# EAGLE board Proiect2026Hagi (EAGLE 9.7.0)
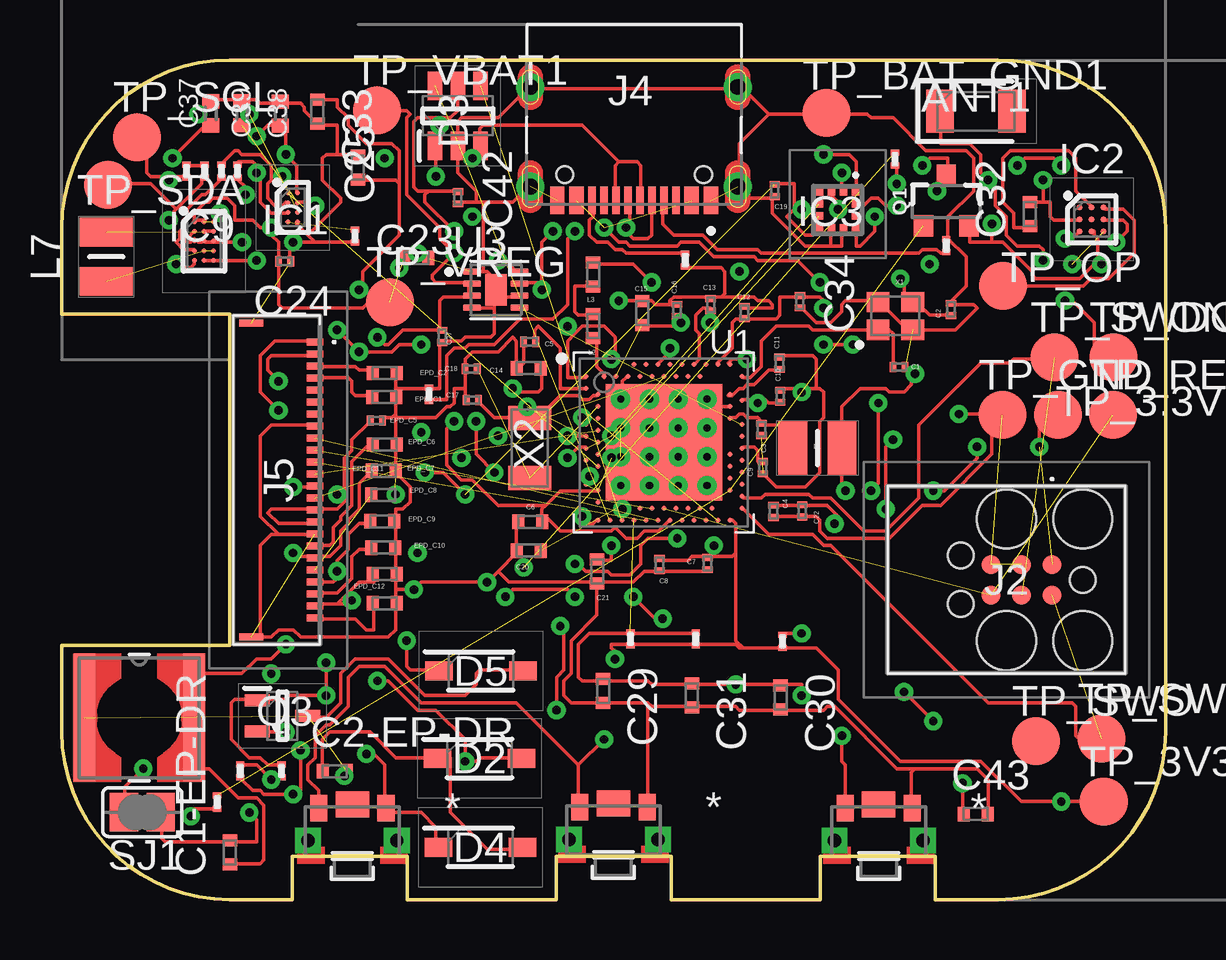
[diagram p2: board, top side]
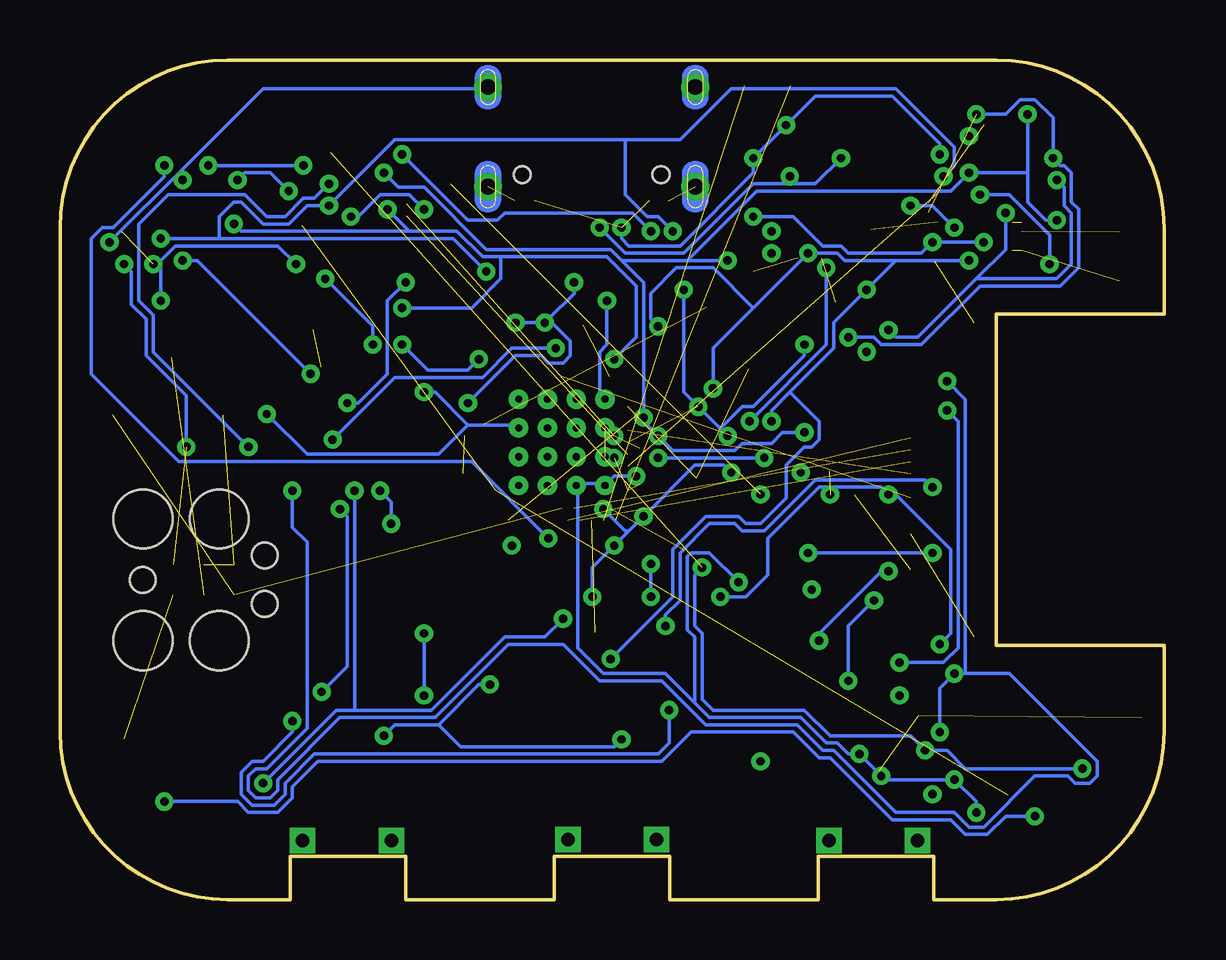
[diagram p3: board, bottom side, seen from below]

Size 46 x 35 mm. Coordinates in mm from the lower left corner, seen from the top.
Outline: 39,0 36.4,0 36.4,1.8 31.6,1.8 31.6,0 25.4,0 25.4,1.8 20.6,1.8 20.6,0 14.4,0 14.4,1.8 9.6,1.8 9.6,0 7,0 arc-90 0,7 0,10.6 7,10.6 7,24.4 0,24.4 0,28 arc-90 7,35 39,35 arc-90 46,28 46,7 arc-90 39,0
Copper layers (1+2*15+16): Top 0.035mm / dielectric 1.5mm / Route2 0.035mm / dielectric 0.15mm / Route15 0.035mm / dielectric 0.2mm / Bottom 0.035mm
Design rules "Fusion Electronics Design Rules *": minimum track width 6mil, minimum drill 0.35mm, track to track 6mil, track to pad 6mil, pad to pad 6mil, via to via 6mil, smd to smd 6mil, copper to edge 40mil, drill to drill 6mil, minimum pad ring 10mil, minimum via ring 8mil, stop-mask expansion 4mil, vias tented up to drill 9999mil, thermal gap 10mil

## Footprints (pad centres in the part's own frame; a part is rotated, then mirrored left to right if it is on the bottom)
2450AT18B100E_ANTC3216X140N = smd 1.15 x 1.8: 1 -1.5,0; 2 1.5,0
NORDIC_NRF_3_RESC0201_L = smd 0.28 x 0.43: 1 -0.255,0; 2 0.255,0
NORDIC_NRF_3_RESC0402_L = smd 0.5 x 0.6: 1 -0.5,0; 2 0.5,0
PERFECT_0402_0402 = smd 0.6 x 0.7: 1 -0.5,0; 2 0.5,0
ESP32_C6_LIBRARY_5_SOD3716X135N = smd 1.15 x 0.8: 1 -1.75,0; 2 1.75,0
ESP32_C6_LIBRARY_3_SOT95P280X145-6N = smd 1.2 x 0.6: 1 -1.25,0.95; 2 -1.25,0; 3 -1.25,-0.95; 4 1.25,-0.95; 5 1.25,0; 6 1.25,0.95
BQ25180YBGR_BGA8C40P2X4_100X155X50 = smd 0.2 x 0.2: A1 -0.2,0.6; A2 0.2,0.6; B1 -0.2,0.2; B2 0.2,0.2; C1 -0.2,-0.2; C2 0.2,-0.2; D1 -0.2,-0.6; D2 0.2,-0.6
DRV2605YZFR_BGA9C50P3X3_144X144X62 = smd 0.25 x 0.25: A1 -0.5,0.5; A2 0,0.5; A3 0.5,0.5; B1 -0.5,0; B2 0,0; B3 0.5,0; C1 -0.5,-0.5; C2 0,-0.5; C3 0.5,-0.5
BMA423_BMA423 = smd 0.3 x 0.35: 1 -0.75,-0.775; 2 -0.25,-0.775; 3 0.25,-0.775; 4 0.75,-0.775; 7 0.75,0.775; 8 0.25,0.775; 9 -0.25,0.775; 10 -0.75,0.775 | smd 0.35 x 0.3: 5 0.775,-0.25; 6 0.775,0.25; 11 -0.775,0.25; 12 -0.775,-0.25
RT6160AWSC_BGA15C40P3X5_140X230X60 = smd 0.216 x 0.216: A1 -0.4,0.8; A2 0,0.8; A3 0.4,0.8; B1 -0.4,0.4; B2 0,0.4; B3 0.4,0.4; C1 -0.4,0; C2 0,0; C3 0.4,0; D1 -0.4,-0.4; D2 0,-0.4; D3 0.4,-0.4; E1 -0.4,-0.8; E2 0,-0.8; E3 0.4,-0.8
TC2030-IDC_TC2030IDC = smd 0.783 x 0.783: 1 -0.953,-0.635; 2 -0.953,0.635; 3 0.317,-0.635; 4 0.317,0.635; 5 1.588,-0.635; 6 1.588,0.635 | hole 2.451: -2.223,-2.54; -2.223,2.54; 0.952,-2.54; 0.952,2.54 | hole 1.067: -2.223,0; 2.857,-1.016; 2.857,1.016
KH-TYPE-C-16P_KINGHELM_KH-TYPE-C-16P = smd 0.6 x 1.15: A1_B12 -3.2,4.725; A4_B9 -2.4,4.725; A9_B4 2.4,4.725; A12_B1 3.2,4.725 | smd 0.3 x 1.15: A5 -1.25,4.725; A6 -0.25,4.725; A7 0.25,4.725; A8 1.25,4.725; B5 1.75,4.725; B6 0.75,4.725; B7 -0.75,4.725; B8 -1.75,4.725 | drill 0.65 pad 1.05: SH1 -4.32,0; SH2 4.32,0; SH3 -4.32,4.15; SH4 4.32,4.15 | hole 0.7: -2.89,3.65; 2.89,3.65
503480-2400_5034802400 = smd 0.3 x 0.7: 1 -5.75,1.525; 2 -5.25,1.525; 3 -4.75,1.525; 4 -4.25,1.525; 5 -3.75,1.525; 6 -3.25,1.525; 7 -2.75,1.525; 8 -2.25,1.525; 9 -1.75,1.525; 10 -1.25,1.525; 11 -0.75,1.525; 12 -0.25,1.525; 13 0.25,1.525; 14 0.75,1.525; 15 1.25,1.525; 16 1.75,1.525; 17 2.25,1.525; 18 2.75,1.525; 19 3.25,1.525; 20 3.75,1.525; 21 4.25,1.525; 22 4.75,1.525; 23 5.25,1.525; 24 5.75,1.525 | smd 0.3 x 1: MP1 -6.54,-1.125; MP2 6.54,-1.125
MLP2016SR47MT0S1_INDC2016X100N = smd 1.2 x 2.2: 1 -1.028,0; 2 1.028,0
NORDIC_NRF_2_RESC0402_L = smd 0.5 x 0.6: 1 -0.5,0; 2 0.5,0
ESP32_C6_LIBRARY_2_IND_4828-WE-TPC_WRE = smd 0.9 x 5.3: 1 -2.286,0; 2 2.286,0
ESP32_C6_LIBRARY_4_ESP32_C6_LIBRARY_4_ESP32_C6_LIBRARY_4_ESP32_C6_LIBRARY_4_ESP32_WROVER_SPARKFUN-DISCRETESEMI_SOT23-3 = smd 0.8 x 0.9: 1 -0.95,-1; 2 0.95,-1; 3 0,1.1
ESP32_C6_LIBRARY_6_SOT65P210X110-3N = smd 1.05 x 0.5: 1 -1.05,0.65; 2 -1.05,-0.65; 3 1.05,0
CPF0201D7K68C1_0201 = smd 0.35 x 0.25: 1 0,0.275; 2 0,-0.275
ESP32_C6_LIBRARY_7_JUMPER_SJ = smd 1.168 x 1.6: 1 -0.762,0; 2 0.762,0
2025-10-22_07-23-44_LIBRARY_SW_EVP-AKE31A_PAN = smd 0.711 x 1.092: 1 -1.4,-0.972; 2 1.4,-0.972 | drill 0.559 pad 0.914 square: 3 -1.848,0.381; 4 1.848,0.381 | smd 1.397 x 1.092: 5 0,-1.124
HECTOR_WATCH_1_TP20R = smd 2 x 2: TP 0,0
NORDIC_NRF_4_AQFN50P700X700X85_HS-74N = smd 4.85 x 4.85: P$74 0,0 | drill 0.3 pad 0.6: P$75 -1.8,1.8; P$76 -0.6,1.8; P$77 0.6,1.8; P$78 1.8,1.8; P$79 -1.8,0.6; P$80 -0.6,0.6; P$81 0.6,0.6; P$82 1.8,0.6; P$83 -1.8,-0.6; P$84 -0.6,-0.6; P$85 0.6,-0.6; P$86 1.8,-0.6; P$87 -1.8,-1.8; P$88 -0.6,-1.8; P$89 0.6,-1.8; P$90 1.8,-1.8 | smd 0.2 x 0.2: P$A8 -1.25,3.25; P$A10 -0.75,3.25; P$A12 -0.25,3.25; P$A14 0.25,3.25; P$A16 0.75,3.25; P$A18 1.25,3.25; P$A20 1.75,3.25; P$A22 2.25,3.25; P$A23 2.75,3.25; P$AA24 3.25,-2.25; P$AB2 -2.75,-2.5; P$AC5 -2,-2.75; P$AC9 -1,-2.75; P$AC11 -0.5,-2.75; P$AC13 0,-2.75; P$AC15 0.5,-2.75; P$AC17 1,-2.75; P$AC19 1.5,-2.75; P$AC21 2,-2.75; P$AC24 3.25,-2.75; P$AD2 -2.75,-3.25; P$AD4 -2.25,-3.25; P$AD6 -1.75,-3.25; P$AD8 -1.25,-3.25; P$AD10 -0.75,-3.25; P$AD12 -0.25,-3.25; P$AD14 0.25,-3.25; P$AD16 0.75,-3.25; P$AD18 1.25,-3.25; P$AD20 1.75,-3.25; P$AD22 2.25,-3.25; P$AD23 2.75,-3.25; P$B1 -3.25,2.75; P$B3 -2.5,2.75; P$B5 -2,2.75; P$B7 -1.5,2.75; P$B9 -1,2.75; P$B11 -0.5,2.75; P$B13 0,2.75; P$B15 0.5,2.75; P$B17 1,2.75; P$B19 1.5,2.75; P$B24 3.25,2.75; P$C1 -3.25,2.25; P$D2 -2.75,2; P$D23 2.75,2; P$E24 3.25,1.75; P$F2 -2.75,1.5; P$F23 2.75,1.5; P$G1 -3.25,1.25; P$H2 -2.75,1; P$H23 2.75,1; P$J1 -3.25,0.75; P$J24 3.25,0.75; P$K2 -2.75,0.5; P$L1 -3.25,0.25; P$L24 3.25,0.25; P$M2 -2.75,0; P$N1 -3.25,-0.25; P$N24 3.25,-0.25; P$P2 -2.75,-0.5; P$P23 2.75,-0.5; P$R1 -3.25,-0.75; P$R24 3.25,-0.75; P$T2 -2.75,-1; P$T23 2.75,-1; P$U1 -3.25,-1.25; P$U24 3.25,-1.25; P$V23 2.75,-1.5; P$W1 -3.25,-1.75; P$W24 3.25,-1.75; P$Y2 -2.75,-2; P$Y23 2.75,-2
ESP32_C6_LIBRARY_SON50P200X200X80-9N = smd 0.76 x 0.27: 1 -0.985,0.75; 2 -0.985,0.25; 3 -0.985,-0.25; 4 -0.985,-0.75; 5 0.985,-0.75; 6 0.985,-0.25; 7 0.985,0.25; 8 0.985,0.75 | smd 0.9 x 1.3: 9 0,0
NORDIC_NRF_BT-XTAL_2016_N = smd 0.95 x 0.85: 1 -0.725,-0.575; 2 0.725,-0.575; 3 0.725,0.575; 4 -0.725,0.575
NORDIC_NRF_1_XTAL_3215_N = smd 1 x 1.8: 1 -1.25,0; 2 1.25,0

## Placement (x,y rotation side)
ANT1  2450AT18B100E  [2450AT18B100E_ANTC3216X140N]  38.09,32.86 0 top
C1  12pF  [NORDIC_NRF_3_RESC0201_L]  34.89,22.2 0 top
C1-EP-DR  10uF  [NORDIC_NRF_3_RESC0402_L]  7.01,1.97 90 top
C2  12pF  [NORDIC_NRF_3_RESC0201_L]  37.06,24.6 90 top
C2-EP-DR  4.7uF/25V  [NORDIC_NRF_3_RESC0402_L]  11.38,5.35 0 top
C3  1pF  [NORDIC_NRF_3_RESC0201_L]  29.16,19.6 270 top
C4  1pF  [NORDIC_NRF_3_RESC0201_L]  29.66,16.18 270 top
C5  100nF  [NORDIC_NRF_3_RESC0201_L]  19.5,23.25 180 top
C6  4.7uF  [NORDIC_NRF_3_RESC0402_L]  19.52,15.75 180 top
C7  100nF  [NORDIC_NRF_3_RESC0201_L]  26.91,14.01 270 top
C8  100nF  [NORDIC_NRF_3_RESC0201_L]  24.91,13.96 270 top
C9  820pF  [NORDIC_NRF_3_RESC0201_L]  29.21,18.01 270 top
C10  N.C  [NORDIC_NRF_3_RESC0201_L]  29.94,20.98 90 top
C11  100pF  [NORDIC_NRF_3_RESC0201_L]  29.91,22.36 90 top
C12  100nF  [NORDIC_NRF_3_RESC0201_L]  28.45,24.47 90 top
C13  N.C  [NORDIC_NRF_3_RESC0201_L]  27.04,24.8 90 top
C14  4.7uF  [NORDIC_NRF_3_RESC0402_L]  19.47,22.15 180 top
C15  1.0uF  [NORDIC_NRF_3_RESC0402_L]  24.19,24.44 90 top
C16  47Nf  [NORDIC_NRF_3_RESC0201_L]  25.64,24.56 90 top
C17  12pF  [NORDIC_NRF_3_RESC0201_L]  17.11,20.82 0 top
C18  12pF  [NORDIC_NRF_3_RESC0201_L]  17.06,22.12 0 top
C19  100nF  [NORDIC_NRF_3_RESC0201_L]  29.71,29.56 270 top
C20  4.7uF  [NORDIC_NRF_3_RESC0402_L]  19.47,14.55 180 top
C21  4.7uF  [NORDIC_NRF_3_RESC0402_L]  22.31,13.68 270 top
C22  N.C  [NORDIC_NRF_3_RESC0201_L]  30.86,16.2 270 top
C23  0.1uF  [NORDIC_NRF_3_RESC0402_L]  14.77,26.75 180 top
C24  10uF  [NORDIC_NRF_3_RESC0201_L]  9.29,26.6 180 top
C25  22uF  [NORDIC_NRF_3_RESC0402_L]  12.34,30.52 90 top
C27  0.1uF  [NORDIC_NRF_3_RESC0201_L]  15.86,23.47 270 top
C29  1uF  [NORDIC_NRF_3_RESC0402_L]  22.56,8.69 270 top
C30  1uF  [NORDIC_NRF_3_RESC0402_L]  29.96,8.43 270 top
C31  1uF  [NORDIC_NRF_3_RESC0402_L]  26.26,8.51 270 top
C32  1uF  [NORDIC_NRF_3_RESC0402_L]  40.34,28.57 90 top
C33  22uF  [NORDIC_NRF_3_RESC0402_L]  10.66,32.85 270 top
C34  0.1uF  [NORDIC_NRF_3_RESC0201_L]  30.76,24.92 270 top
C37  1uF  [PERFECT_0402_0402]  6.21,32.77 90 top
C38  1uF  [PERFECT_0402_0402]  9.11,32.76 90 top
C39  10uF  [PERFECT_0402_0402]  7.51,32.78 90 top
C42  0.1uF  [NORDIC_NRF_3_RESC0201_L]  16.51,29.26 270 top
C43  4.7uF  [NORDIC_NRF_3_RESC0402_L]  38.08,3.57 0 top
D2  MBR0530  [ESP32_C6_LIBRARY_5_SOD3716X135N]  17.41,5.88 0 top
D3  USBLC6-2SC6Y  [ESP32_C6_LIBRARY_3_SOT95P280X145-6N]  16.51,32.67 90 top
D4  MBR0530  [ESP32_C6_LIBRARY_5_SOD3716X135N]  17.45,2.18 0 top
D5  MBR0530  [ESP32_C6_LIBRARY_5_SOD3716X135N]  17.47,9.53 0 top
EPD_C1  1uF/50V  [NORDIC_NRF_3_RESC0402_L]  13.45,20.95 180 top
EPD_C2  1uF/50V  [NORDIC_NRF_3_RESC0402_L]  13.46,21.95 180 top
EPD_C5  0.1uF/50V  [NORDIC_NRF_3_RESC0201_L]  13.11,19.97 180 top
EPD_C6  1uF/50V  [NORDIC_NRF_3_RESC0402_L]  13.47,18.97 180 top
EPD_C7  1uF/50V  [NORDIC_NRF_3_RESC0402_L]  13.43,17.87 180 top
EPD_C8  1uF/50V  [NORDIC_NRF_3_RESC0402_L]  13.39,16.87 180 top
EPD_C9  1uF/50V  [NORDIC_NRF_3_RESC0402_L]  13.35,15.77 180 top
EPD_C10  1uF/50V  [NORDIC_NRF_3_RESC0402_L]  13.41,14.67 180 top
EPD_C11  1uF/50V  [NORDIC_NRF_3_RESC0402_L]  13.47,13.57 180 top
EPD_C12  1uF/50V  [NORDIC_NRF_3_RESC0402_L]  13.47,12.35 180 top
IC1  BQ25180YBGR_BQ25180YBGR  [BQ25180YBGR_BGA8C40P2X4_100X155X50]  9.63,28.85 0 top
IC2  DRV2605YZFR  [DRV2605YZFR_BGA9C50P3X3_144X144X62]  42.92,28.35 0 top
IC3  BMA421  [BMA423_BMA423]  32.33,28.75 180 top
IC9  RT6160AWSC  [RT6160AWSC_BGA15C40P3X5_140X230X60]  5.93,27.45 0 top
J2  TC2030-IDC  [TC2030-IDC_TC2030IDC]  40.32,13.33 180 top
J4  KH-TYPE-C-16P  [KH-TYPE-C-16P_KINGHELM_KH-TYPE-C-16P]  23.85,33.87 180 top
J5  503480-2400  [503480-2400_5034802400]  9.03,17.49 270 top
L1  3.9nH  [MLP2016SR47MT0S1_INDC2016X100N]  31.49,18.82 0 top
L2  10uH  [NORDIC_NRF_2_RESC0402_L]  22.14,23.9 90 top
L3  15nH  [NORDIC_NRF_2_RESC0402_L]  22.14,26.05 90 top
L5  68uH  [ESP32_C6_LIBRARY_2_IND_4828-WE-TPC_WRE]  3.23,7.58 0 top
L7  FTC252012SR47MBCA  [MLP2016SR47MT0S1_INDC2016X100N]  1.86,26.8 270 top
Q1  20V/4.2A/52mΩ/1.4W  [ESP32_C6_LIBRARY_4_ESP32_C6_LIBRARY_4_ESP32_C6_LIBRARY_4_ESP32_C6_LIBRARY_4_ESP32_WROVER_SPARKFUN-DISCRETESEMI_SOT23-3]  36.86,29.09 0 top
Q3  SI1308EDL-T1-GE3  [ESP32_C6_LIBRARY_6_SOT65P210X110-3N]  9.2,7.66 0 top
R1_EP_DR  0.47  [CPF0201D7K68C1_0201]  34.72,30.86 0 top
R1_USB  5K1  [CPF0201D7K68C1_0201]  36.86,27.26 0 top
R2  0  [CPF0201D7K68C1_0201]  7.32,30.36 0 top
R2-USB1  5K1  [CPF0201D7K68C1_0201]  25.98,26.66 0 top
R2_EP_DR  10K  [CPF0201D7K68C1_0201]  9.16,5.36 180 top
R3  0  [CPF0201D7K68C1_0201]  15.3,21.06 0 top
R4  0  [CPF0201D7K68C1_0201]  6.66,30.36 0 top
R5  10K  [CPF0201D7K68C1_0201]  23.7,10.86 0 top
R7  10K  [CPF0201D7K68C1_0201]  30.04,10.76 0 top
R8  10K  [CPF0201D7K68C1_0201]  26.42,10.86 0 top
R9  10K  [CPF0201D7K68C1_0201]  12.22,27.66 180 top
R17  3K3  [CPF0201D7K68C1_0201]  5.2,30.36 0 top
R18  3K3  [CPF0201D7K68C1_0201]  5.96,30.36 0 top
R_PWR_EPD1  10k  [CPF0201D7K68C1_0201]  6.48,4.06 0 top
R_TYPE_SEL  2.2  [CPF0201D7K68C1_0201]  7.44,5.36 0 top
SJ1  [ESP32_C6_LIBRARY_7_JUMPER_SJ]  3.36,3.64 180 top
SW_DN1  2025-10-22_07-23-44_LIBRARY_EVP-AKE31ASW_EVP-AKE31A_PAN  [2025-10-22_07-23-44_LIBRARY_SW_EVP-AKE31A_PAN]  12.11,2.84 180 top
SW_ENT1  2025-10-22_07-23-44_LIBRARY_EVP-AKE31ASW_EVP-AKE31A_PAN  [2025-10-22_07-23-44_LIBRARY_SW_EVP-AKE31A_PAN]  22.99,2.89 180 top
SW_UP1  2025-10-22_07-23-44_LIBRARY_EVP-AKE31ASW_EVP-AKE31A_PAN  [2025-10-22_07-23-44_LIBRARY_SW_EVP-AKE31A_PAN]  34.04,2.84 180 top
TP_3.3V  HECTOR_WATCH_1_TPTP20R  [HECTOR_WATCH_1_TP20R]  41.51,20.2 0 top
TP_3V3  HECTOR_WATCH_1_TPTP20R  [HECTOR_WATCH_1_TP20R]  43.42,4.08 0 top
TP_BAT_GND1  HECTOR_WATCH_1_TPTP20R  [HECTOR_WATCH_1_TP20R]  31.86,32.8 0 top
TP_GND  HECTOR_WATCH_1_TPTP20R  [HECTOR_WATCH_1_TP20R]  39.2,20.2 0 top
TP_ON  HECTOR_WATCH_1_TPTP20R  [HECTOR_WATCH_1_TP20R]  43.82,22.6 0 top
TP_OP  HECTOR_WATCH_1_TPTP20R  [HECTOR_WATCH_1_TP20R]  39.23,25.58 0 top
TP_RESET  HECTOR_WATCH_1_TPTP20R  [HECTOR_WATCH_1_TP20R]  43.8,20.2 0 top
TP_SCL  HECTOR_WATCH_1_TPTP20R  [HECTOR_WATCH_1_TP20R]  3.14,31.78 0 top
TP_SDA  HECTOR_WATCH_1_TPTP20R  [HECTOR_WATCH_1_TP20R]  1.93,29.8 0 top
TP_SWDCLK  HECTOR_WATCH_1_TPTP20R  [HECTOR_WATCH_1_TP20R]  41.36,22.6 0 top
TP_SWDIO  HECTOR_WATCH_1_TPTP20R  [HECTOR_WATCH_1_TP20R]  43.33,6.7 0 top
TP_SWO  HECTOR_WATCH_1_TPTP20R  [HECTOR_WATCH_1_TP20R]  40.59,6.6 0 top
TP_VBAT1  HECTOR_WATCH_1_TPTP20R  [HECTOR_WATCH_1_TP20R]  13.14,32.9 0 top
TP_VREG  HECTOR_WATCH_1_TPTP20R  [HECTOR_WATCH_1_TP20R]  13.68,24.9 0 top
U1  NRF52840_QF  [NORDIC_NRF_4_AQFN50P700X700X85_HS-74N]  25.09,19.06 0 top
U3  MAX17048G+T10  [ESP32_C6_LIBRARY_SON50P200X200X80-9N]  18.09,25.42 0 top
X1  32MHZ  [NORDIC_NRF_BT-XTAL_2016_N]  34.74,24.33 0 top
X2  32.768kHZ  [NORDIC_NRF_1_XTAL_3215_N]  19.5,18.82 90 top

## Tracks (layer width: path | path; a pad name or v marks a point on that pad's centre or on a via)
3V3  (via drill 0.35)  (3 unrouted)
  Top 0.152: 28.09,14.45 28.09,15.67 27.94,15.82 U1.P$AD23 | 28.09,14.45 27.94,14.3 27.17,14.3 | 27.17,14.3 27.02,14.3 C7.1 26.87,14.3 26.26,14.3 26.11,14.14 25.04,14.14 C8.1 | 27.17,14.3 v27.17,14.75 | 28.39,10.49 28.24,10.49 28.09,10.64 26.56,10.64 R8.2 26.41,10.64 23.82,10.64 R5.2 23.67,10.64 22.91,10.64 22.91,10.49 23.06,10.33 v23.06,10.03 | 28.39,10.49 29.92,10.49 R7.2 30.07,10.49 31.44,10.49 32.36,9.57 32.36,8.35 34.95,5.76 38.3,5.76 39.98,4.09 v41.65,4.09 43.33,4.09 TP_3V3.TP | 28.09,14.45 28.09,10.79 28.39,10.49 | v5.38,3.48 5.38,3.63 5.53,3.78 6.45,3.78 R_PWR_EPD1.2 | v40.74,18.87 40.74,20.09 40.89,20.24 41.5,20.24 TP_3.3V.TP | 43.18,26.64 43.18,27.56 43.02,27.71 43.02,27.86 IC2.C2 | 43.18,26.64 42.41,25.88 40.59,25.88 40.43,26.03 40.43,26.18 39.21,27.4 38.76,27.4 | 38.76,27.4 37.84,27.4 37.84,28.01 Q1.2 | 43.18,26.64 v43.33,26.49 | v31.75,24.66 31.75,24.96 31.59,25.12 30.83,25.12 C34.1 30.68,25.12 29.92,25.12 29.92,24.35 29.76,24.2 28.55,24.2 C12.1 28.39,24.2 28.09,24.2 27.94,24.05 27.94,22.98 27.33,22.37 U1.P$A22 | 21.38,23.59 21.69,23.9 22.6,23.9 23.06,23.44 23.06,22.68 v22.91,22.53 | 21.38,23.59 21.08,23.29 21.08,21.76 21.84,21.76 U1.P$B1 | v32.36,28.77 32.36,29.08 32.05,29.38 IC3.3 | v38.76,28.16 38.76,27.4 | 20.01,15.97 20.16,15.97 20.77,15.36 22.91,15.36 23.06,15.52 23.52,15.06 23.97,15.06 24.28,15.36 24.89,15.36 U1.P$AD14 | 20.01,15.97 20.01,15.82 C6.1 20.01,15.97 | 20.16,16.43 20.01,16.28 20.01,15.97 | 20.16,16.43 20.77,17.04 22.3,17.04 U1.P$Y2 | 6.3,26.64 5.99,26.64 IC9.E2 | v8.12,26.64 6.3,26.64 | 6.3,26.64 IC9.E3 | v18.79,21.31 18.94,21.15 19.86,21.15 20.01,21.31 20.01,22.07 C14.1
  Top 0.152: 14.07,29.84 13.92,29.99 12.39,29.99 C25.1 | 14.07,29.84 14.07,27.71 12.54,26.18 12.54,25.57 v12.39,25.42 | 14.07,29.84 14.07,31.21 13.76,31.52 12.7,31.52 11.93,32.28 11.93,32.58 11.48,33.04 11.48,33.35 10.71,33.35 C33.1 | 20.16,16.43 18.18,16.43 17.12,17.5 16.66,17.5 16.05,18.11 16.05,19.63 v16.35,19.94 | v21.08,23.9 21.38,23.59
  Bottom 0.152: v5.38,3.48 6.6,3.48 7.36,2.71 8.28,2.71 8.89,3.32 11.32,3.32 13.92,5.91 14.37,5.91 15.44,6.98 19.71,6.98 20.93,5.76 35.25,5.76 36.32,4.7 36.32,4.24 36.93,3.63 38.15,3.63 38.6,4.09 v41.65,4.09 | v40.74,18.87 40.74,21 42.41,22.68 42.41,24.2 43.02,24.81 43.02,26.18 v43.33,26.49 | 31.44,27.86 v32.36,28.77 | 31.44,27.86 29.46,27.86 28.39,26.79 27.63,26.79 | 27.63,26.79 23.21,26.79 21.99,25.57 21.99,23.44 v22.91,22.53 | v31.75,24.66 28.85,24.66 27.63,25.88 27.63,26.79 | v38.76,28.16 38.45,27.86 31.44,27.86 | 11.17,26.64 v8.12,26.64 | 11.17,26.64 v12.39,25.42 13.76,24.05 13.76,22.98 15.59,21.15 | v16.35,19.94 16.35,20.39 15.59,21.15 | 11.17,26.64 13.31,26.64 13.61,26.95 v14.83,26.95 17.12,24.66 | v18.79,21.31 18.79,22.98 17.12,24.66 | v21.08,23.9 21.38,24.2 21.38,25.27 20.32,26.34 18.79,26.34 17.12,24.66 | v23.06,10.03 20.47,12.62 20.47,14.6 19.1,15.97 17.73,15.97 17.42,15.67 16.81,15.67 15.74,16.73 15.74,18.11 14.98,18.87 14.68,18.87 14.37,19.17 14.37,19.94 15.59,21.15
  other vias: 22.91,18.41
3V3/2.4A  (via drill 0.35)  (1 unrouted)
  Top 0.152: v16.81,16.89 15.9,17.8 v15.13,17.8 | 30.53,28.77 30.22,28.47 30.98,27.71 31.29,27.71 31.44,27.86 IC3.7 | 30.53,28.77 30.53,29.84 29.76,29.84 C19.1 | v33.88,28.47 33.88,27.86 33.27,27.25 33.12,27.25 33.12,27.86 IC3.10 | 30.53,28.77 v30.83,28.77
  Bottom 0.152: v33.88,28.47 33.57,28.47 32.66,29.38 31.44,29.38 v30.83,28.77
ALERT  (1 unrouted)
D+  (1 unrouted)
D-  (1 unrouted)
DN  (via drill 0.35)
  Top 0.152: 23.67,28.01 23.67,29.08 J4.A7 | 23.67,28.01 23.67,27.71 23.82,27.56 24.43,27.56 24.58,27.71 24.58,29.08 J4.B7 | 23.67,28.01 v23.52,28.01 | v15.59,30.15 15.59,31.37 D3.1
  Bottom 0.152: v13.46,30.91 14.52,29.84 15.59,29.84 | 15.59,29.84 17.12,29.84 20.01,26.95 22.45,26.95 v23.52,28.01 | 15.59,29.84 v15.59,30.15
DP
  Top 0.152: 23.21,30.75 23.06,30.6 23.06,29.23 J4.B6 | 23.21,30.75 23.97,30.75 24.13,30.6 24.13,29.23 J4.A6 | 23.21,30.75 21.69,32.28 17.57,32.28 17.42,32.13 17.42,31.52 D3.3
EPD_3V3  (via drill 0.35)
  Top 0.152: v9.34,10.64 8.73,10.03 8.12,10.03 7.51,9.42 5.69,9.42 5.53,9.27 5.53,7.59 L5.2 5.53,7.44 5.53,5.61 5.69,5.46 6.14,5.46 7.36,4.24 8.12,4.24 8.43,3.93 8.43,1.65 8.28,1.49 7.06,1.49 C1-EP-DR.1 | J5.16 10.41,15.67 9.04,15.67 8.58,16.12 8.73,16.28 10.41,16.28 J5.15 10.56,16.28 11.48,16.28 11.78,16.58 11.78,17.19 | 11.78,17.19 11.78,18.41 12.09,18.72 12.09,19.17 12.85,19.94 EPD_C5.2 | v11.48,16.89 11.78,17.19 | v35.86,30.6 36.16,30.91 36.93,30.91 36.93,30.3 Q1.3 | v39.82,30.6 40.13,30.91 41.35,30.91 v41.65,30.6 | v25.65,15.06 24.43,15.06 24.13,14.75 24.13,13.99 23.67,13.53 22.91,13.53 22.75,13.69 21.84,13.69 21.54,13.99 v21.38,13.99 | v21.38,12.62 21.08,12.92 18.79,12.92 v18.49,12.62
  Bottom 0.152: 13.61,17.19 v13.92,16.89 | 13.61,17.19 11.78,17.19 v11.48,16.89 11.17,16.89 8.89,14.6 8.89,11.1 v9.34,10.64 | v39.82,30.6 v35.86,30.6 | v41.65,30.6 41.65,30.15 43.79,28.01 44.24,28.01 44.7,27.56 44.7,21.92 41.04,18.26 28.85,18.26 v25.65,15.06 | v21.38,12.62 v21.38,13.99 | v18.49,12.62 17.42,12.62 16.51,13.53 16.51,15.06 14.37,17.19 13.61,17.19
EPD_BUSY  (1 unrouted)
EPD_CS  (1 unrouted)
EPD_DC  (1 unrouted)
EPD_RST  (1 unrouted)
GDR  (via drill 0.35)
  Top 0.152: v11.02,9.88 v11.02,8.5 9.5,8.5 9.34,8.35 8.28,8.35 Q3.1 8.12,8.35 7.21,8.35 7.06,8.2 7.06,6.68 7.82,5.91 8.28,5.91 8.58,5.61 9.04,5.61 R2_EP_DR.2 | v9.04,20.39 8.28,21.15 8.28,22.68 8.89,23.29 10.41,23.29 J5.1
  Bottom 0.152: v9.04,20.39 8.58,19.94 8.58,10.49 9.19,9.88 v11.02,9.88
GND  (via drill 0.35)  (11 unrouted)
  Top 0.152: C4.2 29.76,15.97 30.83,15.97 C22.2 30.98,15.97 31.44,15.97 31.59,15.82 31.59,15.36 31.9,15.06 34.49,15.06 35.86,16.43 36.62,16.43 38.76,18.56 38.76,20.24 | 38.76,20.24 39.06,20.24 TP_GND.TP 38.76,20.24 | 30.83,21.31 30.07,21.31 C10.2 | 30.83,21.31 31.44,21.31 | 31.44,21.31 31.59,21.31 31.75,21.15 31.75,20.09 31.59,19.94 31.59,17.8 30.98,17.19 29.76,17.19 29.31,17.65 C9.2 | 31.44,21.31 31.44,22.53 31.29,22.68 29.92,22.68 C11.2 | 25.35,24.81 24.73,24.81 24.58,24.96 24.28,24.96 C15.2 24.13,24.96 v23.21,24.96 | 25.35,24.81 25.5,24.81 C16.2 | 27.48,25.12 27.63,25.27 27.63,26.18 27.48,26.34 26.11,26.34 R2-USB1.2 | 27.48,25.12 27.17,25.12 C13.2 27.02,25.12 25.5,25.12 25.35,24.96 25.35,24.81 | 27.48,25.12 28.85,25.12 29,24.96 29.46,24.96 29.61,24.81 29.61,24.66 28.55,24.66 C12.2 | 23.36,21 23.36,21.61 23.52,21.76 U1.P$B7 | 26.87,20.54 26.11,20.54 25.8,20.85 | 26.87,20.54 27.78,20.54 U1.P$F23 | 24.58,18.41 24.58,17.34 | 24.58,18.41 U1.P$84 | 24.58,18.41 U1.P$74 | 24.58,17.34 25.65,17.34 U1.P$89 25.8,17.34 26.87,17.34 U1.P$90 | 24.58,17.34 U1.P$88 | 25.65,19.02 25.65,18.56 U1.P$85 | 25.65,19.02 25.19,19.02 U1.P$74 | U1.P$79 23.36,19.78 23.97,20.39 U1.P$74 | U1.P$80 24.58,19.78 U1.P$74 | U1.P$81 25.65,19.78 25.5,19.94 U1.P$74 | 26.87,18.87 26.87,18.56 U1.P$86 | 26.87,18.87 26.72,19.02 25.65,19.02 | 25.65,19.02 U1.P$74 | 26.87,18.87 26.87,19.63 U1.P$82 | 26.87,18.87 U1.P$74 | 23.36,21 U1.P$75 | 23.36,21 U1.P$74 | U1.P$76 24.43,20.85 24.13,20.85 23.82,20.54 U1.P$74 | 25.8,20.85 U1.P$77 | 25.8,20.85 U1.P$74 | 26.87,20.54 26.87,20.85 U1.P$78 | 26.87,20.54 U1.P$74 | v30.83,21.15 30.83,21.31 | v37.38,20.24 38.76,20.24
  Top 0.152: C34.2 30.83,24.66 31.44,24.05 32.05,24.05 32.51,24.51 32.51,24.81 32.66,24.96 33.88,24.96 X1.4 34.03,24.96 34.34,24.96 34.34,24.66 35.25,23.75 35.4,23.75 X1.2 35.56,23.75 37.23,23.75 38.15,24.66 37.99,24.81 37.08,24.81 C2.2 37.08,24.96 37.69,25.57 37.69,26.79 36.93,27.56 | 32.05,27.25 32.05,27.86 IC3.8 | 32.05,27.25 32.51,27.25 32.51,27.86 IC3.9 | 29.61,29.23 28.24,29.23 28.09,29.38 28.09,29.69 J4.SH3 28.24,29.84 28.24,31.52 29.46,32.74 | 32.05,27.25 30.98,27.25 29.61,28.62 29.61,29.23 | 29.61,29.23 C19.2 | 40.89,29.08 40.43,29.08 C32.2 | 40.89,29.08 41.19,29.08 41.19,28.47 41.35,28.32 42.41,28.32 IC2.B1 | v43.94,27.4 44.4,27.86 44.4,28.16 44.24,28.32 43.48,28.32 IC2.B3 | v40.89,29.99 40.89,29.08 | 29.46,32.74 31.75,32.74 TP_BAT_GND1.TP 31.9,32.74 33.57,32.74 33.73,32.58 34.64,32.58 36.01,31.21 37.69,31.21 37.99,30.91 37.99,29.54 36.93,28.47 36.93,27.56 | 29.46,32.74 28.39,33.8 28.24,33.8 J4.SH1 28.09,33.8 19.55,33.8 J4.SH2 19.4,33.8 18.18,32.58 16.66,32.58 16.51,32.43 16.51,31.52 D3.2 16.51,31.37 16.51,30.3 17.27,29.54 17.27,29.08 | 36.93,27.56 R1_USB.1 | 35.56,5.46 38.15,5.46 38.6,5 38.6,3.63 C43.2 | 35.56,5.46 35.4,5.3 35.4,3.93 SW_UP1.1 | 24.43,8.2 22.6,8.2 C29.2 22.45,8.2 21.23,8.2 20.93,8.5 20.93,9.11 21.23,9.42 21.23,10.79 22.3,11.86 22.3,13.08 C21.2 | 24.43,8.2 24.58,8.05 26.26,8.05 C31.2 26.41,8.05 28.09,8.05 28.24,7.89 29.92,7.89 C30.2 30.07,7.89 31.75,7.89 31.9,8.05 32.2,8.05 34.79,5.46 35.56,5.46 | 24.43,8.2 24.43,3.93 SW_ENT1.1 | SJ1.1 4.16,3.63 4.16,2.56 4.31,2.41 6.9,2.41 C1-EP-DR.2 7.06,2.41 8.12,2.41 8.12,3.32 v7.82,3.63
  Top 0.152: R_TYPE_SEL.1 7.51,5.61 8.12,5.61 v8.73,5 8.89,5.15 9.04,5.15 R2_EP_DR.1 | v12.7,6.07 13,6.07 13.46,5.61 13.46,3.93 SW_DN1.1 13.46,3.78 13.46,3.63 14.98,3.63 15.59,3.02 15.59,2.26 D4.1 | 5.53,27.56 5.69,27.4 5.84,27.4 IC9.C2 5.99,27.4 6.3,27.4 | 5.53,27.56 5.38,27.4 5.23,27.4 5.23,27.56 IC9.B1 | 5.53,27.56 IC9.C1 | 10.56,27.4 10.26,27.71 | 10.26,27.71 9.8,28.16 IC1.D2 | 10.56,27.4 12.09,27.4 R9.1 | 10.56,27.4 v9.65,27.4 9.5,27.4 9.5,26.64 C24.1 | v7.51,27.4 6.3,27.4 | 6.3,27.4 IC9.C3 | 11.48,31.06 11.48,32.28 10.71,32.28 C33.2 10.56,32.43 10.11,32.89 10.11,33.04 9.95,33.19 9.19,33.19 C38.2 9.04,33.19 8.28,33.19 8.12,33.35 7.51,33.35 C39.2 7.36,33.35 6.3,33.35 C37.2 | 11.48,31.06 12.24,31.06 C25.2 | 10.26,27.71 11.63,29.08 11.63,29.23 10.87,29.99 10.87,30.91 11.02,31.06 11.48,31.06 | 18.18,13.69 18.94,14.45 C20.2 18.94,14.6 18.94,15.67 C6.2 | 18.18,13.69 v17.73,13.23 14.98,13.23 v14.68,12.92 13.92,12.92 | C7.2 26.87,13.69 25.04,13.69 C8.2 24.89,13.69 24.28,13.69 23.82,13.23 22.45,13.23 C21.2 | 18.18,13.69 18.64,13.23 22.3,13.23 C21.2 | 17.57,29.08 18.79,29.08 19.4,29.69 J4.SH4 | 17.57,29.08 17.27,29.08 | 17.27,29.08 16.66,29.08 C42.2 | 9.04,15.21 10.41,15.21 J5.17 | 9.04,15.21 8.28,15.97 8.28,19.33 8.73,19.78 10.41,19.78 J5.8 | 18.03,24.66 18.03,25.27 U3.9 | 18.03,24.66 18.03,23.59 17.88,23.44 16.81,23.44 16.66,23.29 15.9,23.29 C27.2 15.74,23.14 15.74,21.31 15.44,21.31 R3.1 15.29,21.31 13.92,21.31 | 18.03,24.66 U3.4 | 17.57,26.18 17.73,26.18 18.03,25.88 18.03,25.42 U3.9 | 17.57,26.18 17.12,26.18 U3.1 | U3.6 18.94,25.12 18.33,25.12 18.18,25.27 U3.9 | 16.81,21.31 16.81,20.85 C17.1
  Top 0.152: 16.81,21.31 16.81,22.07 C18.1 16.81,22.22 16.81,22.53 17.12,22.83 18.18,22.83 18.79,23.44 18.94,23.29 18.94,22.22 C14.2 19.1,22.22 19.25,22.37 19.25,23.14 C5.2 | 13.92,12.92 13.92,13.53 EPD_C11.1 13.92,13.69 13.92,14.6 EPD_C10.1 13.92,14.75 13.92,15.67 EPD_C9.1 13.92,15.82 13.92,16.28 14.22,16.28 14.52,16.58 14.52,17.19 14.07,17.65 13.92,17.65 13.92,17.8 EPD_C7.1 13.92,17.95 13.92,18.87 EPD_C6.1 13.92,19.02 13.92,20.09 | 13.92,12.92 13.92,12.47 EPD_C12.1 13.92,12.31 13.92,11.25 13.61,10.94 9.95,10.94 9.65,11.25 9.04,11.25 8.73,10.94 8.28,10.94 8.28,14.75 8.73,15.21 9.04,15.21 | 13.92,21.31 13.92,21.92 EPD_C2.1 | 13.92,20.24 13.76,20.09 13.46,20.09 EPD_C5.1 | 13.92,20.24 13.92,20.85 EPD_C1.1 13.92,21 13.92,21.31 | 13.92,20.24 13.92,20.09 | 16.81,21.31 16.35,21.31 16.35,20.7 16.2,20.54 16.05,20.54 15.59,20.09 13.92,20.09 | 17.57,26.18 17.57,28.47 | 17.57,28.47 17.57,29.08 | 17.57,28.47 v17.12,28.47
  Bottom 0.152: v21.99,17.65 22.91,17.65 23.21,17.34 U1.P$87 23.36,17.34 24.43,17.34 U1.P$88 24.43,17.19 24.43,10.49 23.36,9.42 20.77,9.42 19.55,8.2 | v23.21,24.96 23.21,23.14 23.52,22.83 23.52,21.15 23.36,21 U1.P$75 | v30.83,21.15 30.37,21.15 29,19.78 | 29,19.78 27.02,19.78 U1.P$82 | v37.38,20.24 35.71,18.56 30.22,18.56 29,19.78 | 40.89,30.45 37.54,33.8 28.24,33.8 J4.SH1 | 40.89,30.45 v43.94,27.4 | 40.89,30.45 v40.89,29.99 | v7.82,3.63 7.82,4.09 v8.73,5 11.63,5 v11.78,5.15 v12.7,6.07 13.15,6.07 13.61,6.52 14.07,6.52 15.13,7.59 18.94,7.59 19.55,8.2 | v7.51,27.4 v9.65,27.4 10.11,26.95 13.15,26.95 13.46,27.25 14.22,27.25 15.44,28.47 v17.12,28.47 | 19.55,8.2 19.55,10.94 19.86,11.25 19.86,14.3 19.71,14.45 18.94,14.45 v17.73,13.23
IMU_INT1  (via drill 0.35)  (2 unrouted)
  Top 0.152: v21.08,18.41 21.54,18.87 21.84,18.87 U1.P$N1
  Bottom 0.152: v16.66,18.41 v21.08,18.41
  other vias: 22.91,19.33
IMU_INT2  (1 unrouted)
LX1  (1 unrouted)
  Top 0.152: IC9.B2 5.99,27.86 6.3,27.86 IC9.B3
LX2  (2 unrouted)
MOSI  (1 unrouted)
N$1
  Top 0.152: IC9.D1 5.53,27.1 5.08,27.1 4.77,27.4 4.92,27.56 4.92,27.86 5.08,28.01 5.08,28.32 5.23,28.47 5.23,28.77 5.84,29.38 5.99,29.38 6.6,29.99 R4.2
N$4
  Top 0.152: U1.P$C1 20.77,21.31 20.77,22.98 19.86,23.9 19.71,23.75 19.71,23.29 C5.1
N$5
  Top 0.152: U1.P$N24 28.39,18.87 28.85,18.87 29,18.72 29,18.26 29.16,18.26 C9.1
N$6  (1 unrouted)
N$7
  Top 0.152: U1.P$D23 27.78,21 27.94,21 28.24,21.31 28.39,21.31 28.55,21.46 28.85,21.46 29.46,22.07 29.76,22.07 C11.1
N$8  (via drill 0.35)
  Top 0.152: v4.77,26.49 4.92,26.34 5.38,26.34 5.53,26.49 IC9.E1 | v7.67,29.38 7.67,29.69 7.36,29.99 R2.2
  Bottom 0.152: v4.77,26.49 4.77,27.71 6.45,29.38 v7.67,29.38
N$9  (1 unrouted)
N$10
  Top 0.152: R1_USB.2 36.77,26.95 36.62,26.95 36.47,27.1 35.86,27.1 35.71,26.95 29.16,26.95 29,27.1 27.33,27.1 26.72,27.71 25.5,27.71 25.04,28.16 25.04,29.08 J4.A5
N$11  (via drill 0.35)
  Top 0.152: v21.38,27.86 21.08,27.56 21.08,24.81 20.47,24.2 19.1,24.2 18.03,23.14 16.96,23.14 16.81,22.98 16.35,22.98 16.05,22.68 16.05,20.85 15.44,20.85 R3.2 | v31.75,31.06 32.81,31.06 33.12,30.75 33.12,29.54 IC3.1
  Bottom 0.152: v21.38,27.86 22.14,28.62 27.48,28.62 27.78,28.32 29,28.32 v31.75,31.06
N$13
  Top 0.152: U1.P$B3 22.6,21.76 22.6,21.92 22.3,22.22 22.3,23.44 22.14,23.44 L2.1
N$14  (via drill 0.35)  (1 unrouted)
  Top 0.152: 29,20.85 29.31,20.85 29.46,20.7 29.92,20.7 C10.1 | 29,20.85 28.39,20.85 U1.P$E24 | 25.5,23.9 25.65,24.05 25.65,24.2 C16.1 | 25.5,23.9 24.28,23.9 C15.1 | v25.8,24.05 25.65,23.9 25.5,23.9 | v24.58,25.73 23.82,26.49 22.14,26.49 L3.2 | v29,20.7 29,20.85
  Bottom 0.152: v27.02,24.05 v25.8,24.05 25.65,24.2 | v24.58,25.73 24.58,25.27 25.65,24.2 | v29,20.7 27.02,22.68 25.95,22.68 25.65,22.37 25.04,22.37 24.73,22.68 24.73,23.29 25.65,24.2
N$15
  Top 0.152: U1.P$H23 27.94,20.09 28.09,20.09 28.24,20.24 28.39,20.24 28.55,20.09 29,20.09 29.16,19.94 C3.1 29.31,19.78 30.53,19.78 30.53,18.87 L1.1
N$16  (via drill 0.35)
  Top 0.152: ANT1.1 36.62,32.74 36.62,31.52 37.84,31.52 38.3,31.06 38.3,30.3 v38.6,29.99 38.91,29.69 38.91,28.93 39.37,28.47 39.37,27.71 39.82,27.25 40.74,27.25 40.89,27.1 v40.89,26.64 | C4.1 29.76,16.43 30.83,16.43 C22.1 30.98,16.43 31.9,16.43 32.36,15.97 32.36,15.82 v32.2,15.67 | v35.56,21.92 35.4,21.76 35.4,21.46 35.1,21.15 34.49,21.15 34.34,21.31 33.27,21.31 32.51,20.54 32.51,18.87 L1.2 32.51,18.72 32.51,17.19 v32.66,17.04
  Bottom 0.152: v36.47,29.54 37.23,30.3 38.3,30.3 v38.6,29.99 | v32.2,15.67 32.2,16.58 v32.66,17.04 | v40.89,26.64 40.28,26.64 v35.56,21.92
N$17
  Top 0.152: U1.P$B24 28.39,21.76 28.7,21.76 29.16,22.22 29.16,23.29 29.76,23.9 31.14,23.9 31.29,23.75 33.88,23.75 X1.1 34.03,23.75 34.49,23.75 34.64,23.59 34.64,22.22 C1.1
N$18  (via drill 0.35)
  Top 0.152: v28.55,22.53 27.94,22.53 27.78,22.37 U1.P$A23 | v32.97,23.14 v31.75,23.14 | v34.95,25.88 35.1,25.73 35.1,25.12 35.4,24.81 X1.3 35.56,24.96 35.71,24.96 35.71,24.81 36.16,24.35 36.93,24.35 C2.1
  Bottom 0.152: v28.55,22.53 29,22.07 30.68,22.07 v31.75,23.14 | v32.97,23.14 32.97,23.9 v34.95,25.88
N$19
  Top 0.152: U1.P$D2 22.3,21 22.14,21 21.99,20.85 21.69,20.85 21.54,21 20.77,21 19.71,19.94 19.55,19.94 X2.2 19.4,19.94 19.1,19.94 18.94,20.09 18.03,20.09 17.42,20.7 C17.2
N$20  (2 unrouted)
N$21
  Top 0.152: L2.2 21.99,24.35 21.54,24.35 21.38,24.51 21.38,25.57 21.99,25.57 L3.1
N$22
  Top 0.152: R17.1 5.23,30.6 5.84,30.6 R18.1
N$23
  Top 0.152: U1.P$A18 26.41,22.37 26.56,22.53 26.56,23.59 26.41,23.75 26.41,24.35 26.72,24.66 27.02,24.66 C13.1
N$24
  Top 0.152: R2-USB1.1 25.95,26.95 23.52,26.95 23.36,27.1 23.06,27.1 22.75,27.4 22.3,27.4 21.99,27.71 21.99,28.32 22.14,28.47 22.14,29.08 J4.B5
N$28
  Top 0.152: IC2.A2 42.87,28.93 42.26,29.54 42.26,30.91 41.96,31.21 39.52,31.21 39.21,30.91 39.21,29.08 39.67,28.62 39.67,28.01 40.28,28.01 C32.1
N$32
  Top 0.152: EPD_C2.2 12.85,22.07 12.39,22.07 12.24,22.22 10.56,22.22 J5.3
N$33
  Top 0.152: EPD_C1.2 12.85,21 12.24,21 12.09,21.15 12.09,21.61 11.93,21.76 10.56,21.76 J5.4
N$34
  Top 0.152: EPD_C6.2 12.85,18.87 12.7,18.87 12.09,18.26 12.09,16.43 11.63,15.97 11.63,15.82 11.32,15.52 11.32,14.91 11.17,14.75 10.56,14.75 J5.18
N$35  (via drill 0.35)
  Top 0.152: v9.65,14.45 9.8,14.3 10.41,14.3 J5.19 10.56,14.3 11.17,14.3 11.63,14.75 11.63,15.36 11.93,15.67 11.93,15.82 12.39,16.28 12.39,17.34 12.85,17.8 EPD_C7.2
  Bottom 0.152: v9.65,14.45 v14.83,14.45
N$37  (1 unrouted)
N$39
  Top 0.152: EPD_C10.2 12.85,14.6 12.39,14.6 12.09,14.3 12.09,13.38 11.48,12.77 10.56,12.77 J5.22
N$42
  Top 0.152: EPD_C12.2 13,12.31 13,11.25 12.7,11.25 12.24,11.7 10.56,11.7 J5.24
N$43  (2 unrouted)
  Top 0.152: Q3.3 10.26,7.59 11.02,7.59 11.63,8.2 11.63,9.42 12.24,10.03 13.61,10.03 15.13,8.5 16.81,8.5 17.27,8.96 17.27,9.42 17.42,9.57 19.1,9.57 D5.2
N$44
  Top 0.152: C2-EP-DR.1 10.87,5.46 10.87,6.68 11.17,6.98 12.85,6.98 13.92,5.91 15.59,5.91 D2.1 15.74,5.91 16.2,5.91 16.2,3.63 17.73,2.1 19.1,2.1 D4.2
N$45  (via drill 0.35)  (1 unrouted)
  Top 0.152: R_TYPE_SEL.2 7.51,5 7.97,4.54 8.28,4.54 8.43,4.39 v9.65,4.39 9.8,4.39 9.95,4.54 v9.95,6.22 | v3.4,5.46 2.64,4.7 2.64,3.78 SJ1.2
  Bottom 0.152: v19.25,13.84 19.55,13.53 19.55,11.4 19.25,11.1 19.25,8.35 18.79,7.89 14.98,7.89 13.92,6.83 10.56,6.83 v9.95,6.22 9.04,6.22 8.28,5.46 v3.4,5.46
OUT+
  Top 0.152: IC2.A3 43.48,28.77 44.24,28.77 44.7,28.32 44.7,26.95 43.63,25.88 42.87,25.88 42.57,25.57 39.37,25.57 TP_OP.TP
OUT-  (via drill 0.35)  (1 unrouted)
  Top 0.152: v41.8,24.96 42.11,24.96 43.02,24.05 43.02,22.83 43.33,22.53 43.79,22.53 TP_ON.TP
  Bottom 0.152: v36.16,26.49 36.93,27.25 41.19,27.25 41.8,26.64 | 41.8,26.64 41.96,26.49 v42.11,26.49 41.8,26.64 | 41.8,26.64 v41.8,24.96
P0.13  (via drill 0.35)  (1 unrouted)
  Top 0.152: 21.54,5.61 18.94,8.2 14.98,8.2 13.46,9.72 12.39,9.72 11.93,9.27 11.93,8.05 11.17,7.29 11.02,7.29 10.56,6.83 10.56,5.91 10.26,5.61 10.26,5 10.71,4.54 10.71,3.93 SW_DN1.2 | 21.54,5.61 21.54,3.93 SW_ENT1.2 | v32.51,6.83 32.51,5.76 32.66,5.61 32.66,3.93 SW_UP1.2 | v30.83,11.1 30.07,11.1 R7.1 | R8.1 26.41,11.1 23.82,11.1 R5.1 23.67,11.1 21.99,11.1 21.54,10.64 21.54,9.27 21.69,9.11 22.45,9.11 C29.1 22.6,9.11 24.43,9.11 24.58,8.96 26.26,8.96 C31.1 26.41,8.96 v28.09,8.96 29.92,8.96 C30.1 30.07,8.96 30.83,8.96 v30.83,8.5 | v22.6,6.68 21.54,5.61
  Bottom 0.152: v30.83,8.5 v30.83,11.1 | v32.51,6.83 32.05,7.29 30.22,7.29 | 30.22,7.29 28.55,8.96 v28.09,8.96 | v22.6,6.68 22.91,6.37 29.31,6.37 30.22,7.29
P0.26  (1 unrouted)
P1.01  (2 unrouted)
PMIC_INT  (1 unrouted)
PREVGH  (via drill 0.35)
  Top 0.152: v14.37,10.79 14.37,9.72 14.52,9.57 15.59,9.57 D5.1 | J5.21 10.56,13.23 11.32,13.23 11.48,13.38 v11.48,13.69 11.48,14.14 11.93,14.6 11.93,15.21 12.39,15.67 12.85,15.67 EPD_C9.2
  Bottom 0.152: v14.37,10.79 14.37,11.1 11.78,13.69 v11.48,13.69
PREVGL  (via drill 0.35)
  Top 0.152: D2.2 19.1,5.91 17.42,5.91 17.27,5.76 v16.81,5.76 16.81,6.68 15.59,7.89 14.83,7.89 13.61,9.11 v13.15,9.11 | v12.09,12.47 11.93,12.31 11.48,12.31 | 11.48,12.31 10.56,12.31 J5.23 | 11.48,12.31 12.39,13.23 13,13.23 13,13.53 EPD_C11.2
  Bottom 0.152: v13.15,9.11 13.15,11.4 v12.09,12.47
RESE  (via drill 0.35)
  Top 0.152: v9.04,21.61 8.58,22.07 8.58,22.53 8.73,22.68 10.41,22.68 J5.2 | v34.79,29.84 34.79,30.6 R1_EP_DR.2 | v38.15,18.87 38.15,18.41 36.77,17.04 v36.32,17.04 | v9.34,6.98 8.28,6.98 Q3.2
  Bottom 0.152: v34.79,29.84 35.4,29.23 35.86,29.23 36.62,28.47 37.38,28.47 38.3,29.38 41.5,29.38 42.72,28.16 42.72,24.96 42.11,24.35 42.11,22.83 v38.15,18.87 | v36.32,17.04 36.32,15.52 35.71,14.91 35.71,7.13 37.38,5.46 37.84,5.46 38.15,5.15 38.15,4.54 37.84,4.24 37.23,4.24 36.93,4.54 36.93,5 34.34,7.59 30.37,7.59 27.33,10.64 25.04,10.64 23.52,9.11 20.93,9.11 19.1,7.29 15.29,7.29 14.22,6.22 13.76,6.22 11.17,3.63 8.73,3.63 8.12,3.02 7.51,3.02 5.38,5.15 4.01,5.15 3.7,4.85 3.09,4.85 2.79,5.15 2.79,5.76 6.45,9.42 8.28,9.42 | 8.28,9.42 v8.73,9.42 9.34,8.81 v9.34,6.98 | v9.04,21.61 8.28,20.85 8.28,9.42
RESET  (2 unrouted)
SCK  (via drill 0.35)
  Top 0.152: v25.35,22.98 25.19,22.83 25.19,22.68 24.89,22.37 U1.P$A12 | v34.64,19.17 34.34,18.87 v34.34,16.28 | v36.32,7.44 v35.1,8.66 | v20.62,7.89 20.62,9.27 20.93,9.57 20.93,11.25 v20.77,11.4 | v9.65,17.19 10.41,17.19 J5.13
  Bottom 0.152: v25.35,22.98 27.17,22.98 28.39,21.76 32.05,21.76 v34.64,19.17 | v34.34,16.28 34.03,15.97 34.03,9.72 v35.1,8.66 | v36.32,7.44 36.32,6.98 37.54,5.76 37.99,5.76 38.45,5.3 38.45,4.39 37.99,3.93 37.08,3.93 36.62,4.39 36.62,4.85 35.4,6.07 21.08,6.07 20.62,6.52 v20.62,7.89 | v20.77,11.4 20.77,11.86 20.16,12.47 20.16,14.45 18.94,15.67 17.88,15.67 17.57,15.36 16.66,15.36 14.52,17.5 9.95,17.5 v9.65,17.19
SCL  (via drill 0.35)  (1 unrouted)
  Top 0.152: 4.47,30.15 3.7,30.15 3.55,30.3 3.55,31.82 3.25,31.82 TP_SCL.TP | 4.47,30.15 5.08,30.15 R17.2 | v11.48,23.75 v12.39,22.83 13.76,22.83 14.07,23.14 v14.98,23.14 | v4.47,29.99 4.47,30.15 | 20.01,25.57 19.86,25.73 19.1,25.73 U3.7 | 8.73,30.15 8.73,30.6 8.28,31.06 7.51,31.06 7.36,31.21 7.21,31.21 6.75,30.75 R4.1 | 8.73,30.15 8.73,29.99 8.58,29.84 8.58,29.23 8.89,28.93 9.19,28.93 9.34,29.08 IC1.B1 | v41.8,27.56 42.11,27.56 IC2.C1 | v34.79,28.93 34.34,28.93 34.03,29.23 33.73,29.23 33.42,28.93 33.12,28.93 IC3.12 | v9.19,30.15 8.73,30.15 | 20.01,25.57 20.01,27.4 v20.47,27.86 | 20.01,25.57 v20.01,25.42
  Bottom 0.152: v6.6,28.62 6.6,27.1 7.82,25.88 | 7.82,25.88 10.26,23.44 11.17,23.44 v11.48,23.75 | v4.47,29.99 4.16,29.69 4.16,28.93 3.86,28.62 3.86,26.49 4.47,25.88 7.82,25.88 | 18.49,19.63 v19.4,20.54 20.01,21.15 v20.01,25.42 | 18.49,19.63 v18.18,19.33 | 39.37,27.56 29.61,27.56 v28.24,26.18 | 39.37,27.56 v41.8,27.56 | 39.37,27.56 39.37,28.47 38.76,29.08 38.45,29.08 37.54,28.16 36.47,28.16 35.71,28.93 v34.79,28.93 32.05,31.67 22.45,31.67 | v9.19,30.15 8.73,30.6 8.73,31.37 11.17,33.8 18.03,33.8 20.16,31.67 22.45,31.67 | v20.47,27.86 21.08,28.47 21.54,28.47 22.45,29.38 22.45,31.67 | v14.98,23.14 14.98,22.68 17.12,20.54 17.57,20.54 18.49,19.63
SDA  (via drill 0.35)
  Top 0.152: 8.28,30.3 8.28,30.45 7.97,30.75 7.36,30.75 R2.1 | 8.28,30.3 8.28,29.08 8.73,28.62 9.34,28.62 IC1.C1 | 4.77,28.77 4.47,28.47 v4.47,28.32 | 4.77,28.77 5.84,29.84 5.84,29.99 R18.2 | v8.12,30.3 8.28,30.3 | 4.77,28.77 3.7,29.84 2.03,29.84 TP_SDA.TP | v21.08,19.33 21.84,19.33 U1.P$L1 | v32.51,30.3 32.51,29.54 IC3.2 | v18.18,26.64 18.49,26.64 18.94,26.18 U3.8
  Bottom 0.152: 5.69,30.3 5.69,29.08 4.92,28.32 v4.47,28.32 | 5.69,30.3 v5.69,32.74 | 5.69,30.3 v8.12,30.3 8.89,29.54 16.96,29.54 19.86,26.64 | v14.98,19.48 15.9,19.48 16.35,19.02 17.57,19.02 17.88,18.72 20.47,18.72 v21.08,19.33 21.69,19.94 v21.69,20.09 21.69,25.73 22.6,26.64 | v32.51,30.3 31.9,29.69 30.83,29.69 28.24,27.1 23.06,27.1 22.6,26.64 | v18.18,26.64 19.86,26.64 | 19.86,26.64 22.6,26.64
SWDCLK  (1 unrouted)
  Top 0.152: U1.P$AA24 28.39,16.73 29.16,16.73 29.31,16.89 31.14,16.89 31.29,16.73 32.05,16.73 33.42,15.36 34.34,15.36 35.71,16.73 35.71,19.78 38.3,22.37 39.52,22.37 39.67,22.53 41.35,22.53 TP_SWDCLK.TP
SWDIO  (1 unrouted)
  Top 0.152: U1.P$AC24 28.39,16.28 29.46,15.21 31.29,15.21 31.75,14.75 32.05,14.75 38.6,8.2 42.11,8.2 42.26,8.05 42.26,6.83 42.41,6.68 43.33,6.68 TP_SWDIO.TP
VBAT  (via drill 0.35)  (1 unrouted)
  Top 0.152: v4.62,30.91 5.84,32.13 6.14,32.13 C37.1 | 15.74,23.75 15.74,24.96 15.9,25.12 16.96,25.12 U3.3 16.96,25.27 16.96,25.57 U3.2 16.96,25.73 15.59,25.73 15.44,25.88 15.44,26.03 v16.35,26.95 15.74,27.56 15.74,28.01 14.37,29.38 14.37,32.58 14.52,32.74 14.37,32.89 13.15,32.89 TP_VBAT1.TP | v13.15,23.44 13.46,23.14 13.61,23.14 14.22,23.75 15.74,23.75 | 15.74,23.75 C27.1
  Bottom 0.152: v7.82,32.74 6.6,32.74 5.99,33.35 5.38,33.35 4.62,32.58 v4.62,30.91 4.31,30.6 4.16,30.6 3.86,30.3 3.86,29.08 3.55,28.77 3.55,26.34 4.31,25.57 7.67,25.57 10.11,23.14 11.78,23.14 12.09,23.44 v13.15,23.44
VBUS  (via drill 0.35)  (2 unrouted)
  Top 0.152: IC1.A2 9.8,29.54 9.8,30.6 v9.34,31.06 9.34,32.28 9.19,32.28 C38.1 9.04,32.28 8.58,32.28 v8.12,31.82 | 15.29,29.54 16.51,29.54 C42.1 | 15.29,29.54 15.13,29.38 15.13,29.08 v16.35,27.86 | 15.9,32.58 15.74,32.43 v15.74,32.28 15.9,32.58 | 15.9,32.58 16.2,32.58 16.51,32.89 16.51,33.8 D3.5 | 15.29,29.54 14.83,29.54 14.68,29.69 14.68,32.43 14.83,32.58 15.9,32.58 | v21.69,15.97 21.99,15.67 22.14,15.67 22.3,15.82 U1.P$AD2 | v17.27,19.94 17.27,18.56 v18.03,17.8 | v37.54,4.85 37.54,3.63 C43.1 | v25.04,11.7 24.73,11.7 v23.82,12.62 | v22.91,14.75 22.91,14.14 22.45,14.14 C21.1 | v22.6,28.01 23.21,27.4 23.52,27.4 23.67,27.25 25.65,27.25 25.8,27.4 26.56,27.4 27.17,26.79 28.85,26.79 29,26.64 30.68,26.64 v31.59,25.73 | v34.03,20.7 34.03,17.34 v33.73,17.04
  Bottom 0.152: v9.34,31.06 9.34,31.52 11.32,33.5 14.52,33.5 v15.74,32.28 v17.12,30.91 17.12,30.3 20.16,27.25 22.3,27.25 22.6,27.56 v22.6,28.01 | 22.3,15.36 v22.91,14.75 23.82,13.84 v23.82,12.62 | 22.3,15.36 v21.69,15.97 19.55,18.11 18.33,18.11 v18.03,17.8 | v23.36,16.28 22.45,15.36 22.3,15.36 | v14.07,26.34 14.07,23.14 v17.27,19.94 | v37.54,4.85 34.49,7.89 33.73,7.89 | 33.73,7.89 30.53,7.89 27.48,10.94 25.8,10.94 v25.04,11.7 | v31.59,25.73 32.36,24.96 32.36,21.92 33.57,20.7 v34.03,20.7 | 33.73,7.89 v33.73,17.04
VREG  (via drill 0.35)  (3 unrouted)
  Top 0.152: 5.53,28.32 5.99,28.32 IC9.A2 | v10.56,28.93 10.41,29.08 9.8,29.08 IC1.B2 | 5.53,28.32 5.53,28.62 5.99,29.08 6.14,29.08 6.3,29.23 6.9,29.23 7.21,28.93 7.21,28.32 7.97,28.32 8.28,28.01 v8.73,28.01 8.73,27.71 9.04,27.4 9.04,26.64 C24.2 9.04,26.49 9.04,24.81 9.19,24.66 12.54,24.66 12.85,24.96 13.61,24.96 TP_VREG.TP | 5.53,28.32 IC9.A1
  Bottom 0.152: v10.56,28.93 9.65,28.93 v8.73,28.01